# EAGLE design Laser Driver (EAGLE 6.2)
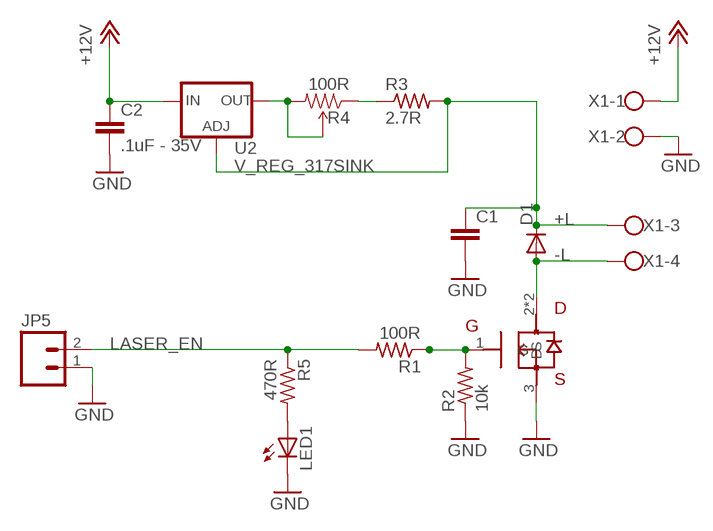
[diagram p0: schematic, sheet 1]

## Parts
C1  C-EUC0805  [C0805]
C2  .1uF - 35V  C-EUC1206  [C1206]
D1  DIODEPTH  [DIODE-1N4001]
JP5  M02PTH  [1X02]
LED1  LEDCHIPLED_0805  [CHIPLED_0805]
R1  100R  R-US_R0805  [R0805]
R2  10k  R-US_R0805  [R0805]
R3  2.7R  R-US_0411/12  [0411/12]
R4  100R  TRIMPOT  [3362U-2]
R5  470R  R-US_R0805  [R0805]
U2  V_REG_317SINK  [TO220-ADJ]
U$2  MOSFET  [SOT223]
X1  W237-4  [W237-4]

## Nets
+12V: C2.1 U2.IN X1.1
+L: C1.1 D1.C R3.2 U2.ADJ X1.3
-L: D1.A U$2.2(D) U$2.4(D) X1.4
GND: C1.2 C2.2 JP5.1 LED1.C R2.1 U$2.3(S) X1.2
LASER_EN: JP5.2 R1.2 R5.1
LED_ON: R1.1 R2.2 U$2.1(G)
N$1: LED1.A R5.2
N$2: R4.2(WIPER) R4.3(CW) U2.OUT
N$3: R3.1 R4.1(CCW)

## Library data of the parts
C1 C2 = rcl:C-EU: CAPACITOR, European symbol
D1 = SparkFun:DIODE: Diode These are standard reverse protection diodes and small signal diodes. SMA package can handle up to about 1A. SOD-323 can handle about 200mA. What the SOD-323 package when ordering, there are some mfgs out there that are 5-pin packages.
JP5 = SparkFun:M02: Header 2 Standard 2-pin 0.1" header. Use with straight break away headers (SKU : PRT-00116), right angle break away headers (PRT-00553), swiss pins (PRT-00743), machine pins (PRT-00117), and female headers (PRT-00115). Molex polarized connector foot print use with SKU : PRT-08233 with associated crimp pins and housings.
LED1 = led:LED: LED OSRAM: - CHIPLED LG R971, LG N971, LY N971, LG Q971, LY Q971, LO R971, LY R971 LH N974, LH R974 LS Q976, LO Q976, LY Q976 LO Q996 - Hyper CHIPLED LW Q18S LB Q993, LB Q99A, LB R99A - SideLED LS A670, LO A670, LY A670, LG A670, LP A670 LB A673, LV A673, LT A673, LW A673 LH A674 LY A675 LS A676, LA A676, LO A676, LY A676, LW A676 LS A679, LY A679, LG A679 - Hyper Micro SIDELED® LS Y876, LA Y876, LO Y876, LY Y876 LT Y87S - SmartLED LW L88C, LW L88S LB L89C, LB L89S, LG L890 LS L89K, LO L89K, LY L89K LS L896, LA L896, LO L896, LY L896 - TOPLED LS T670, LO T670, LY T670, LG T670, LP T670 LSG T670, LSP T670, LSY T670, LOP T670, LYG T670 LG T671, LOG T671, LSG T671 LB T673, LV T673, LT T673, LW T673 LH T674 LS T676, LA T676, LO T676, LY T676, LB T676, LH T676, LSB T676, LW T676 LB T67C, LV T67C, LT T67C, LS T67K, LO T67K, LY T67K, LW E67C LS E67B, LA E67B, LO E67B, LY E67B, LB E67C, LV E67C, LT E67C LW T67C LS T679, LY T679, LG T679 LS T770, LO T770, LY T770, LG T770, LP T770 LB T773, LV T773, LT T773, LW T773 LH T774 LS E675, LA E675, LY E675, LS T675 LS T776, LA T776, LO T776, LY T776, LB T776 LHGB T686 LT T68C, LB T68C - Hyper Mini TOPLED® LB M676 - Mini TOPLED Santana® LG M470 LS M47K, LO M47K, LY M47K Source: http://www.osram.convergy.de LUXEON: - LUMILED® LXK2-PW12-R00, LXK2-PW12-S00, LXK2-PW14-U00, LXK2-PW14-V00 LXK2-PM12-R00, LXK2-PM12-S00, LXK2-PM14-U00 LXK2-PE12-Q00, LXK2-PE12-R00, LXK2-PE12-S00, LXK2-PE14-T00, LXK2-PE14-U00 LXK2-PB12-K00, LXK2-PB12-L00, LXK2-PB12-M00, LXK2-PB14-N00, LXK2-PB14-P00, LXK2-PB14-Q00 LXK2-PR12-L00, LXK2-PR12-M00, LXK2-PR14-Q00, LXK2-PR14-R00 LXK2-PD12-Q00, LXK2-PD12-R00, LXK2-PD12-S00 LXK2-PH12-R00, LXK2-PH12-S00 LXK2-PL12-P00, LXK2-PL12-Q00, LXK2-PL12-R00 Source: www.luxeon.com KINGBRIGHT: KA-3528ASYC Source: www.kingbright.com
R1-R3 R5 = rcl:R-US_: RESISTOR, American symbol
R4 = SparkFun:TRIMPOT
U2 = SparkFun:V_REG_317: Voltage Regulator Standard LM317 adjustable voltage regulator. AOI (Adjust Output Input). Google 'LM317 Calculator' for easy to use app to get the two resistor values needed. 240/720 for 5V output. 240/390 for 3.3V output. Spark Fun Electronics SKU : COM-00527
U$2 = NJC:MOSFET
X1 = con-wago-500:W237-4: WAGO SCREW CLAMP; OC_FARNELL: unknown; OC_NEWARK: unknown

## Board
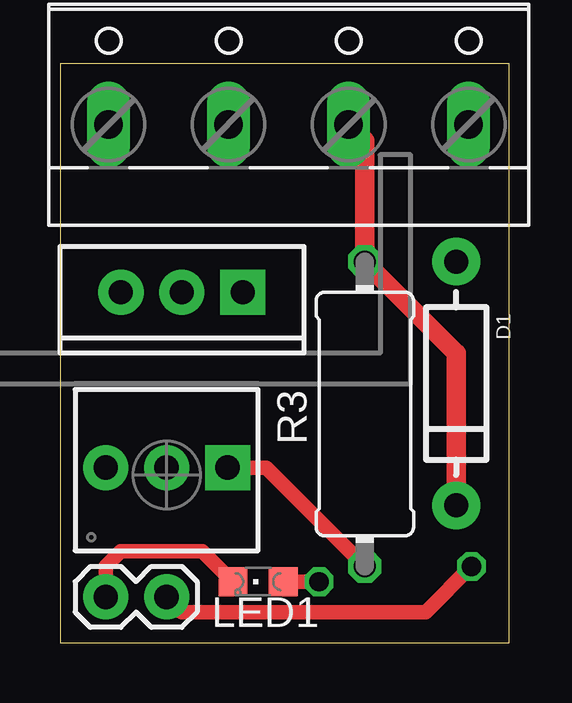
[diagram p1: board, top side]
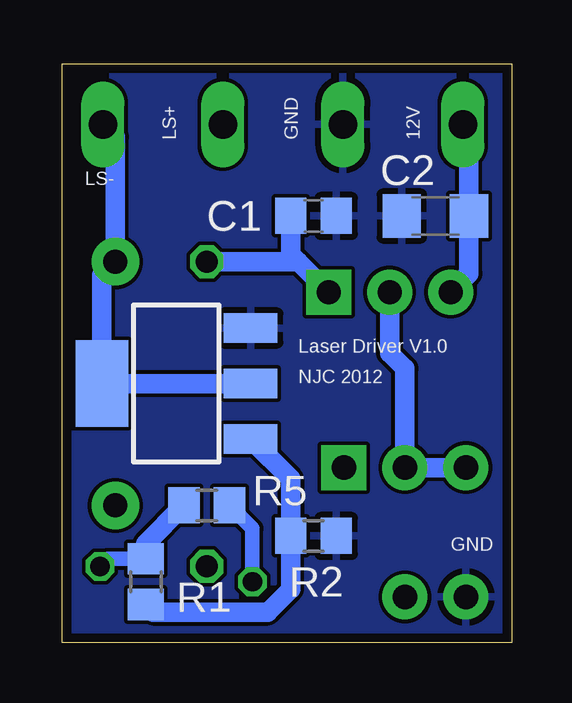
[diagram p2: board, bottom side, seen from below]

Size 18.72 x 24.12 mm. Coordinates in mm from the lower left corner, seen from the top.
Outline: 0,0 18.72,0 18.72,24.12 0,24.12 0,0
Copper layers (1*16): Top 0.0356mm / dielectric 1.5011mm / Bottom 0.0356mm
Design rules: minimum track width 6mil, minimum drill 13mil, track to track 6mil, track to pad 6mil, pad to pad 6mil, via to via 6mil, smd to smd 6mil, copper to edge 15mil, drill to drill 6mil, minimum pad ring 7mil, minimum via ring 7mil, stop-mask expansion 4mil, vias tented up to drill 0mil, thermal gap 10mil

### Footprints (pad centres in the part's own frame; a part is rotated, then mirrored left to right if it is on the bottom)
C0805 = smd 1.3 x 1.5: 1 -0.95,0; 2 0.95,0
C1206 = smd 1.6 x 1.8: 1 -1.4,0; 2 1.4,0
DIODE-1N4001 = drill 1 pad 1.981: A -5.08,0; C 5.08,0
1X02 = drill 1.016 pad 1.88: 1 0,0; 2 2.54,0
CHIPLED_0805 = smd 1.2 x 1.2: A 0,-1.05; C 0,1.05
R0805 = smd 1.3 x 1.5: 1 -0.95,0; 2 0.95,0
0411/12 = drill 0.914 octagon: 1 -6.35,0; 2 6.35,0
3362U-2 = drill 1.016 pad 1.88 square: 1 -2.54,-0.305 | drill 1.016 pad 1.88: 2 0,-0.305; 3 2.54,-0.305
TO220-ADJ = drill 1 pad 1.88 square: ADJ -2.54,0 | drill 1 pad 1.88: IN 2.54,0; OUT 0,0
SOT223 = smd 1.219 x 2.235: 1 -2.311,-3.099; 2 0,-3.099; 3 2.311,-3.099 | smd 3.6 x 2.2: 4 0,3.099
W237-4 = drill 1.194 long: 1 -7.5,-1.27; 2 -2.5,-1.27; 3 2.5,-1.27; 4 7.5,-1.27

### Placement (x,y rotation side)
C1  8.26,17.78 0 bottom
C2  3.17,17.78 180 bottom
D1  16.51,10.79 270 top
JP5  1.91,1.91 0 top
LED1  8.26,2.54 90 top
R1  15.24,2.54 90 bottom
R2  8.26,4.45 180 bottom
R3  12.7,9.53 90 top
R4  4.45,6.99 180 top
R5  12.7,5.71 0 bottom
U2  5.08,14.61 180 top
U$2  13.97,10.79 90 bottom
X1  9.53,22.86 0 top

### Tracks (layer width: path | path; a pad name or v marks a point on that pad's centre or on a via)
+12V
  Bottom 0.813: X1.1 1.77,21.34 C2.1 1.77,15.37 U2.IN
+L
  Top 0.813: D1.C 16.51,12.06 R3.2 12.7,20.91 X1.3
  Bottom 0.813: U2.ADJ 8.89,15.88 | 8.89,15.88 9.21,16.19 C1.1 | R3.2 8.89,15.88
-L
  Bottom 0.813: X1.4 16.51,21.07 D1.A 17.07,15.32 U$2.4 U$2.2
GND
  Top 0.61: LED1.C 5.93,3.81 2.54,3.81 1.91,3.17 JP5.1
  pour Bottom: 0,24.13 19.05,24.13 19.05,0 0,0
LASER_EN  (via drill 0.8)
  Top 0.61: JP5.2 5.08,1.27 15.24,1.27 v17.14,3.17
  Bottom 0.61: v17.14,3.17 16.83,3.49 R1.2
  Bottom 0.813: R5.1 15.24,4.12 R1.2
LED_ON
  Bottom 0.813: U$2.1 9.21,6.82 R2.2 9.21,2.23 10.16,1.27 14.92,1.27 R1.1
N$1  (via drill 0.8)
  Top 0.61: LED1.A v10.79,2.54
  Bottom 0.61: v10.79,2.54 10.79,4.76 R5.2
N$2
  Bottom 0.813: R4.3 R4.2 4.45,11.43 5.08,12.06 U2.OUT
N$3
  Top 0.61: R3.1 8.59,7.29 R4.1

### Text on the board
bNames: 12V | GND | LS+ | LS- | Laser Driver V1.0 | NJC 2012 | GND